# EAGLE schematic PDCViewer (EAGLE 6.5.0)
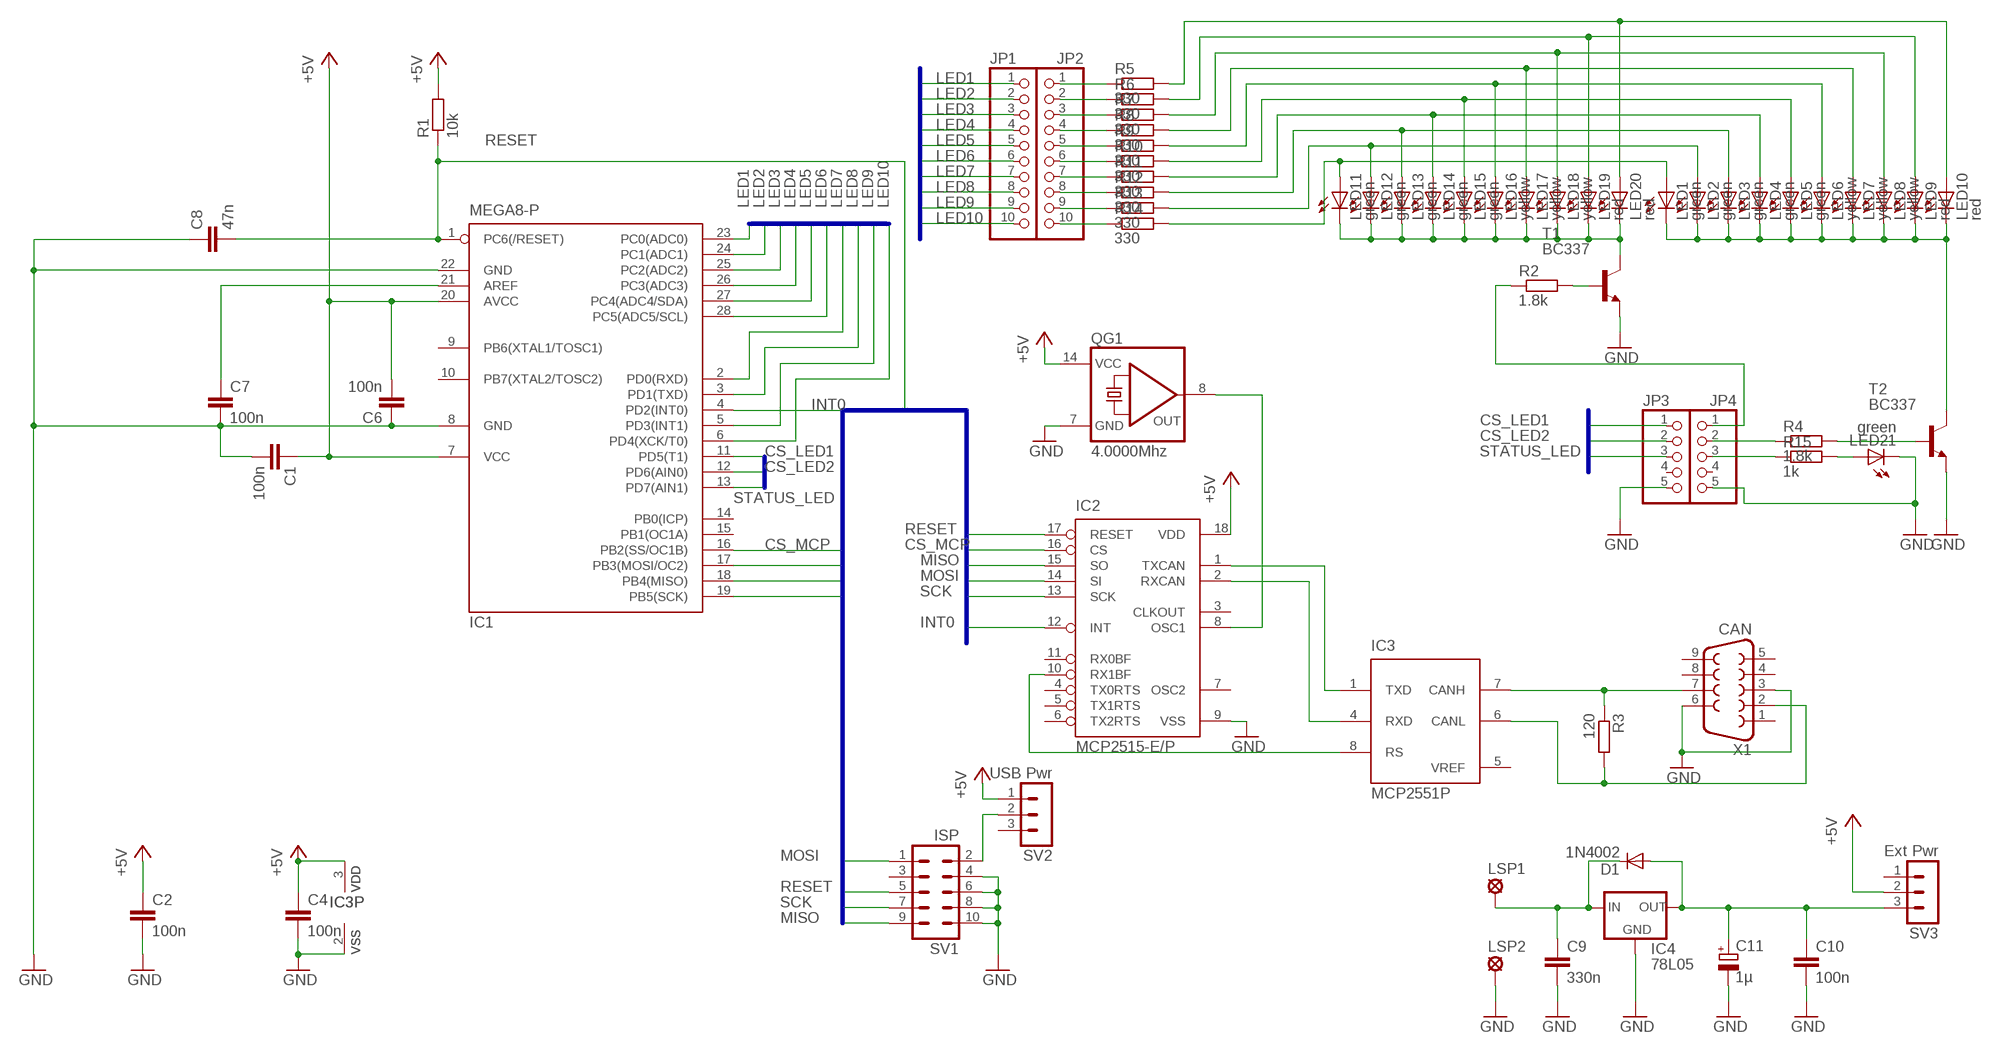
[diagram p0: schematic, sheet 1]

## Parts
C1  100n  C-EU050-025X075  [C050-025X075]
C2  100n  C-EU050-025X075  [C050-025X075]
C4  100n  C-EU050-025X075  [C050-025X075]
C6  100n  C-EU050-025X075  [C050-025X075]
C7  100n  C-EU050-025X075  [C050-025X075]
C8  47n  C-EU050-025X075  [C050-025X075]
C9  330n  C-EU050-025X075  [C050-025X075]
C10  100n  C-EU050-025X075  [C050-025X075]
C11  1µ  CPOL-EUE2.5-7  [E2,5-7]
D1  1N4002  1N4004  [DO41-10]
IC1  MEGA8-P  [DIL28-3]
IC2  MCP2515-E/P  [DIL18]
IC3  MCP2551P  [DIL8]
IC4  78L05  78LXX  [78LXX]
JP1  PINHD-1X10  [1X10]
JP2  PINHD-1X10/90  [1X10/90]
JP3  PINHD-1X5  [1X05]
JP4  PINHD-1X5/90  [1X05/90]
LED1  green  LED3MM  [LED3MM]
LED2  green  LED3MM  [LED3MM]
LED3  green  LED3MM  [LED3MM]
LED4  green  LED3MM  [LED3MM]
LED5  green  LED3MM  [LED3MM]
LED6  yellow  LED3MM  [LED3MM]
LED7  yellow  LED3MM  [LED3MM]
LED8  yellow  LED3MM  [LED3MM]
LED9  red  LED3MM  [LED3MM]
LED10  red  LED3MM  [LED3MM]
LED11  green  LED3MM  [LED3MM]
LED12  green  LED3MM  [LED3MM]
LED13  green  LED3MM  [LED3MM]
LED14  green  LED3MM  [LED3MM]
LED15  green  LED3MM  [LED3MM]
LED16  yellow  LED3MM  [LED3MM]
LED17  yellow  LED3MM  [LED3MM]
LED18  yellow  LED3MM  [LED3MM]
LED19  red  LED3MM  [LED3MM]
LED20  red  LED3MM  [LED3MM]
LED21  green  LED3MM  [LED3MM]
LSP1  +12V  SE14  [SE14]
LSP2  SE14  [SE14]
QG1  4.0000Mhz  QG5860  [DIL14S]
R1  10k  R-EU_0207/2V  [0207/2V]
R2  1.8k  R-EU_0204/2V  [0204V]
R3  120  R-EU_0207/2V  [0207/2V]
R4  1.8k  R-EU_0204/2V  [0204V]
R5  330  R-EU_0204/2V  [0204V]
R6  330  R-EU_0204/2V  [0204V]
R7  330  R-EU_0204/2V  [0204V]
R8  330  R-EU_0204/2V  [0204V]
R9  330  R-EU_0204/2V  [0204V]
R10  330  R-EU_0204/2V  [0204V]
R11  330  R-EU_0204/2V  [0204V]
R12  330  R-EU_0204/2V  [0204V]
R13  330  R-EU_0204/2V  [0204V]
R14  330  R-EU_0204/2V  [0204V]
R15  1k  R-EU_0204/2V  [0204V]
SV1  ISP  ML10  [ML10]
SV2  USB Pwr  MA03-1  [MA03-1]
SV3  Ext Pwr  MA03-1  [MA03-1]
T1  BC337  [TO92]
T2  BC337  [TO92]
X1  CAN  F09HP  [F09HP]

## Nets
+5V: C1.1 C2.1 C4.1 C6.2 IC1.7(VCC) IC1.20(AVCC) IC2.18(VDD) IC3.3(VDD) QG1.14(VCC) R1.2 SV2.1 SV3.2
+12V: C9.1 D1.C IC4.IN LSP1.MP
CS_LED1: IC1.11(PD5(T1)) JP3.1
CS_LED2: IC1.12(PD6(AIN0)) JP3.2
CS_MCP: IC1.16(PB2(SS/OC1B)) IC2.16(CS)
GND: C1.2 C2.2 C4.2 C6.1 C7.2 C8.1 C9.2 C10.2 C11.- IC1.8(GND) IC1.22(GND) IC2.9(VSS) IC3.2(VSS) IC4.GND JP3.5 JP4.5 LED21.K(C) LSP2.MP QG1.7(GND) SV1.4 SV1.6 SV1.8 SV1.10 T1.1(E) T2.1(E) X1.3 X1.6
INT0: IC1.4(PD2(INT0)) IC2.12(INT)
LED1: IC1.23(PC0(ADC0)) JP1.1
LED2: IC1.24(PC1(ADC1)) JP1.2
LED3: IC1.25(PC2(ADC2)) JP1.3
LED4: IC1.26(PC3(ADC3)) JP1.4
LED5: IC1.27(PC4(ADC4/SDA)) JP1.5
LED6: IC1.28(PC5(ADC5/SCL)) JP1.6
LED7: IC1.2(PD0(RXD)) JP1.7
LED8: IC1.3(PD1(TXD)) JP1.8
LED9: IC1.5(PD3(INT1)) JP1.9
LED10: IC1.6(PD4(XCK/T0)) JP1.10
MISO: IC1.18(PB4(MISO)) IC2.15(SO) SV1.9
MOSI: IC1.17(PB3(MOSI/OC2)) IC2.14(SI) SV1.1
N$1: IC2.1(TXCAN) IC3.1(TXD)
N$2: R2.2 T1.2(B)
N$3: R4.2 T2.2(B)
N$4: LED1.A LED11.A R14.2
N$5: IC3.7(CANH) R3.1 X1.7
N$6: IC3.6(CANL) R3.2 X1.2
N$7: IC2.10(RX1BF) IC3.8(RS)
N$8: C7.1 IC1.21(AREF)
N$9: LED11.K(C) LED12.K(C) LED13.K(C) LED14.K(C) LED15.K(C) LED16.K(C) LED17.K(C) LED18.K(C) LED19.K(C) LED20.K(C) T1.3(C)
N$10: LED2.A LED12.A R13.2
N$11: LED1.K(C) LED2.K(C) LED3.K(C) LED4.K(C) LED5.K(C) LED6.K(C) LED7.K(C) LED8.K(C) LED9.K(C) LED10.K(C) T2.3(C)
N$12: LED3.A LED13.A R12.2
N$13: IC2.2(RXCAN) IC3.4(RXD)
N$14: LED4.A LED14.A R11.2
N$15: LED5.A LED15.A R10.2
N$16: LED6.A LED16.A R9.2
N$17: LED7.A LED17.A R8.2
N$18: IC2.8(OSC1) QG1.8(OUT)
N$19: LED8.A LED18.A R7.2
N$20: LED9.A LED19.A R6.2
N$21: SV1.2 SV2.2
N$22: LED10.A LED20.A R5.2
N$23: LED21.A R15.2
N$24: JP2.1 R5.1
N$25: JP2.2 R6.1
N$26: JP2.3 R7.1
N$27: JP2.4 R8.1
N$28: JP2.5 R9.1
N$29: JP2.6 R10.1
N$30: JP2.7 R11.1
N$31: JP2.8 R12.1
N$32: JP2.9 R13.1
N$33: C10.1 C11.+ D1.A IC4.OUT SV3.3
N$34: JP2.10 R14.1
N$35: JP4.3 R15.1
N$36: JP4.2 R4.1
N$37: JP4.1 R2.1
RESET: C8.2 IC1.1(PC6(/RESET)) IC2.17(RESET) R1.1 SV1.5
SCK: IC1.19(PB5(SCK)) IC2.13(SCK) SV1.7
STATUS_LED: IC1.13(PD7(AIN1)) JP3.3
Unconnected: IC1.9(PB6(XTAL1/TOSC1)) IC1.10(PB7(XTAL2/TOSC2)) IC1.14(PB0(ICP)) IC1.15(PB1(OC1A)) IC2.3(CLKOUT) IC2.4(TX0RTS) IC2.5(TX1RTS) IC2.6(TX2RTS) IC2.7(OSC2) IC2.11(RX0BF) JP3.4 JP4.4 SV1.3 SV2.3 SV3.1 X1.1 X1.4 X1.5 X1.8 X1.9

## Buses
INT0,CS_MCP,MOSI,MISO,SCK,RESET
LED1,LED2,LED3,LED4,LED5,LED6,LED7,LED8,LED9,LED10
CS_LED1,CS_LED2,STATUS_LED

## Power pins joined to a net without a drawn wire
VREF: IC3.5(VREF)

## Library data of the parts
C1 C2 C4 C6-C10 = resistor:C-EU: CAPACITOR, European symbol
C11 = resistor:CPOL-EU: POLARIZED CAPACITOR, European symbol
D1 = diode:1N4004: DIODE general purpose rectifier, 1 A
IC1 = atmel:MEGA8-P: MICROCONTROLLER 8 Kbytes FLASH, 1 kbytes SRAM, 512 bytes EEPROM, USART, 4-channel 10 bit ADC, 2-channel 8 bit ADC Pin compatible with Atmega48, ATMega88, ATMega168 Source: avr.lbr; OC_FARNELL: unknown; OC_NEWARK: unknown
IC2 = mcp2515:MCP2515
IC3 = microchip_can:MCP2551: High Speed CAN tranceiver
IC4 = v-reg:78LXX: VOLTAGE REGULATOR
JP1 JP2 = pinhead:PINHD-1X10: PIN HEADER
JP3 JP4 = pinhead:PINHD-1X5: PIN HEADER
LED1-LED21 = led:LED: LED OSRAM: - CHIPLED LG R971, LG N971, LY N971, LG Q971, LY Q971, LO R971, LY R971 LH N974, LH R974 LS Q976, LO Q976, LY Q976 LO Q996 - Hyper CHIPLED LW Q18S LB Q993, LB Q99A, LB R99A - SideLED LS A670, LO A670, LY A670, LG A670, LP A670 LB A673, LV A673, LT A673, LW A673 LH A674 LY A675 LS A676, LA A676, LO A676, LY A676, LW A676 LS A679, LY A679, LG A679 - Hyper Micro SIDELED® LS Y876, LA Y876, LO Y876, LY Y876 LT Y87S - SmartLED LW L88C, LW L88S LB L89C, LB L89S, LG L890 LS L89K, LO L89K, LY L89K LS L896, LA L896, LO L896, LY L896 - TOPLED LS T670, LO T670, LY T670, LG T670, LP T670 LSG T670, LSP T670, LSY T670, LOP T670, LYG T670 LG T671, LOG T671, LSG T671 LB T673, LV T673, LT T673, LW T673 LH T674 LS T676, LA T676, LO T676, LY T676, LB T676, LH T676, LSB T676, LW T676 LB T67C, LV T67C, LT T67C, LS T67K, LO T67K, LY T67K, LW E67C LS E67B, LA E67B, LO E67B, LY E67B, LB E67C, LV E67C, LT E67C LW T67C LS T679, LY T679, LG T679 LS T770, LO T770, LY T770, LG T770, LP T770 LB T773, LV T773, LT T773, LW T773 LH T774 LS E675, LA E675, LY E675, LS T675 LS T776, LA T776, LO T776, LY T776, LB T776 LHGB T686 LT T68C, LB T68C - Hyper Mini TOPLED® LB M676 - Mini TOPLED Santana® LG M470 LS M47K, LO M47K, LY M47K Source: http://www.osram.convergy.de LUXEON: - LUMILED® LXK2-PW12-R00, LXK2-PW12-S00, LXK2-PW14-U00, LXK2-PW14-V00 LXK2-PM12-R00, LXK2-PM12-S00, LXK2-PM14-U00 LXK2-PE12-Q00, LXK2-PE12-R00, LXK2-PE12-S00, LXK2-PE14-T00, LXK2-PE14-U00 LXK2-PB12-K00, LXK2-PB12-L00, LXK2-PB12-M00, LXK2-PB14-N00, LXK2-PB14-P00, LXK2-PB14-Q00 LXK2-PR12-L00, LXK2-PR12-M00, LXK2-PR14-Q00, LXK2-PR14-R00 LXK2-PD12-Q00, LXK2-PD12-R00, LXK2-PD12-S00 LXK2-PH12-R00, LXK2-PH12-S00 LXK2-PL12-P00, LXK2-PL12-Q00, LXK2-PL12-R00 Source: www.luxeon.com KINGBRIGHT: KA-3528ASYC Source: www.kingbright.com
LSP1 LSP2 = solpad:SE14: SOLDER PAD E1553, drill 1,4mm, distributor Buerklin, 07F820
QG1 = crystal:QG5860: CRYSTAL RESONATOR; OC_FARNELL: unknown; OC_NEWARK: unknown
R1-R15 = resistor:R-EU_: RESISTOR, European symbol
SV1 = con-ml:ML10: HARTING; OC_FARNELL: unknown; OC_NEWARK: unknown
SV2 SV3 = con-lstb:MA03-1: PIN HEADER; OC_FARNELL: unknown; OC_NEWARK: unknown
T1 T2 = transistor:BC337: NPN TRANSISTOR
X1 = con-subd:F09: SUB-D; OC_FARNELL: unknown; OC_NEWARK: unknown

## Net classes
0 default: clearance 0.205 mm